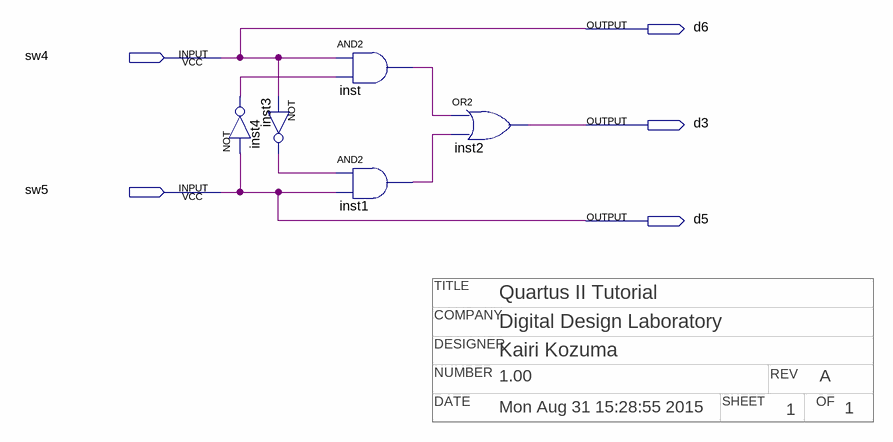
[diagram p0: schematic sheet]
// Quartus schematic tutorial.bdf as structural Verilog: 5 symbols, 5 pins
// Title block: TITLE: Quartus II Tutorial; COMPANY: Digital Design Laboratory; DESIGNER: Kairi Kozuma; NUMBER: 1.00; REV: A; DATE: Mon Aug 31 15:28:55 2015; SHEET: 1; OF: 1
module tutorial (
  input  sw4,
  input  sw5,
  output d6,
  output d3,
  output d5
);

  wire inst1_out, inst3_out, inst4_out, inst_out;

  not inst4 (inst4_out, sw5);
  not inst3 (inst3_out, sw4);
  and inst (inst_out, sw4, inst4_out);
  and inst1 (inst1_out, inst3_out, sw5);
  or inst2 (d3, inst_out, inst1_out);

  assign d5 = sw5;
  assign d6 = sw4;
endmodule
